# Altium schematic sheet Main.SchDoc
size A4; Author: Wojciech Gredel; CompanyName: AGH UST; Revision: 1; ProjectName: My_project1
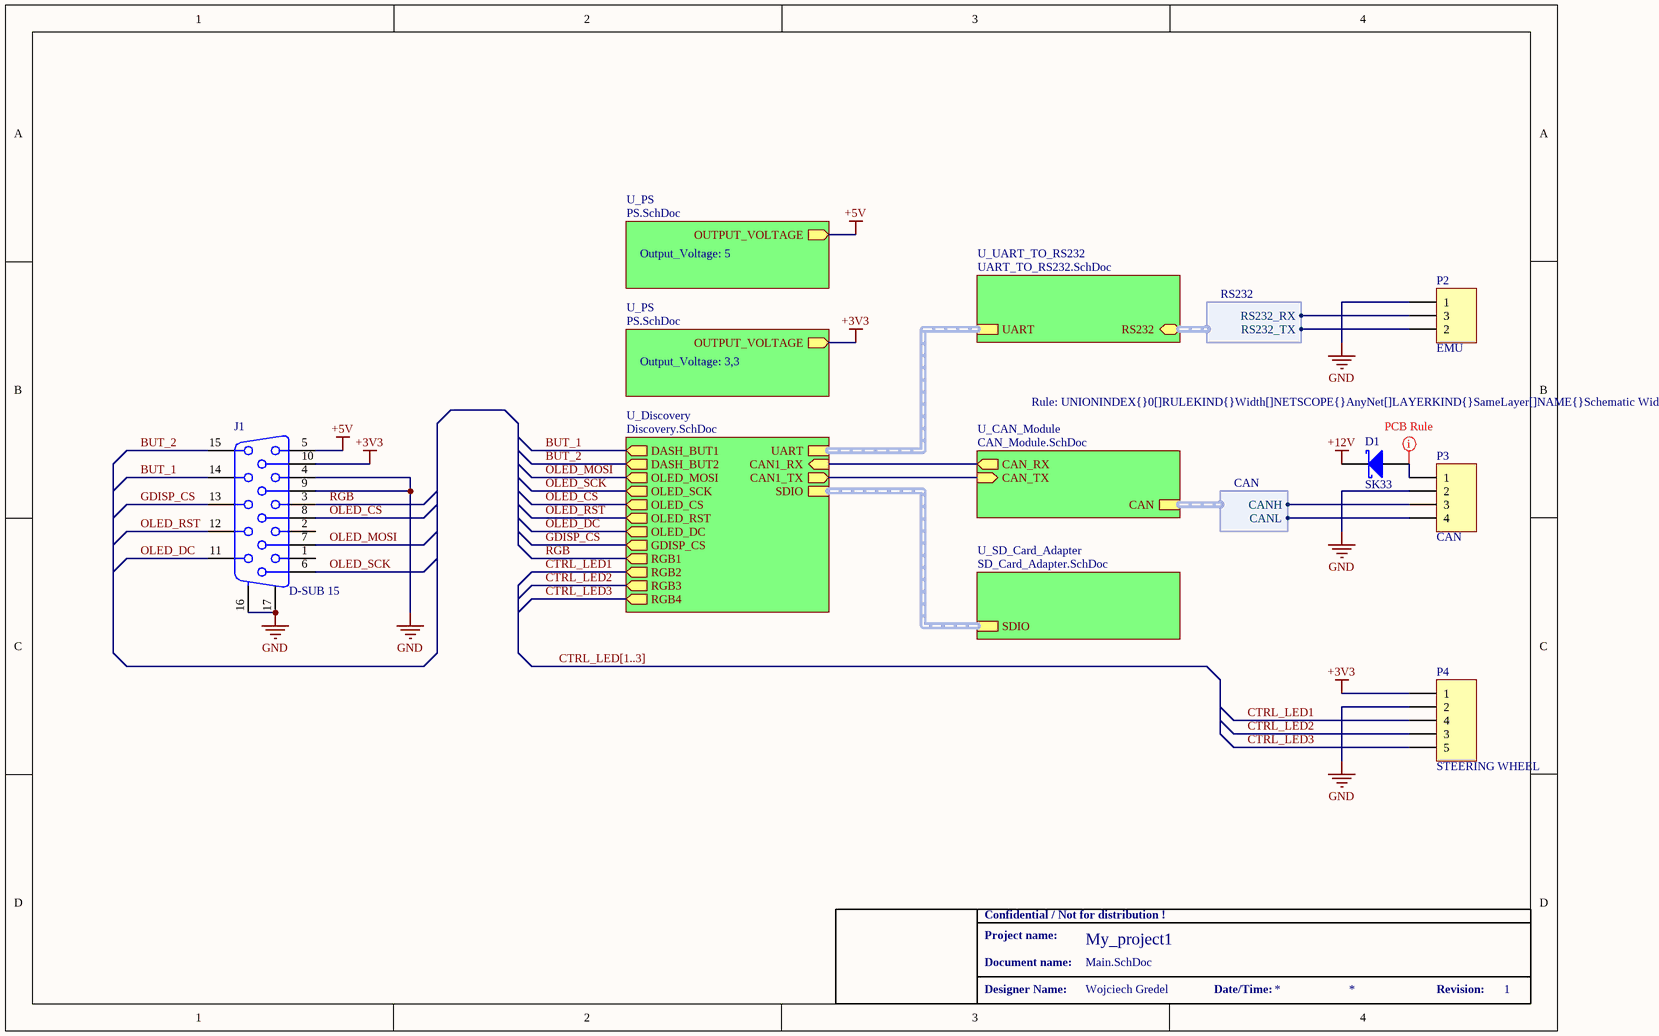
[diagram p0: Main.SchDoc]

## Parts
D1  SK33  [DO214AB_IPC_MD]
J1  D-SUB 15  [Dsub-3H15]
P2  EMU  [HDR_1x3_3_94_LOCKING]
P3  CAN  [HDR_1x4_3_94_LOCKING]
P4  STEERING WHEEL  [HDR_1x5_3_94_LOCKING]

## Sub-sheets
U_CAN_Module = CAN_Module.SchDoc: CAN (harness CAN), CAN_RX (out), CAN_TX (in)
U_Discovery = Discovery.SchDoc: UART (harness UART), SDIO (harness SDIO), DASH_BUT2 (out), OLED_MOSI (out), DASH_BUT1 (out), OLED_SCK (out), OLED_CS (out), OLED_RST (out), OLED_DC (out), GDISP_CS (out), CAN1_RX (in), CAN1_TX (out), RGB1 (out), RGB2 (out), RGB3 (out), RGB4 (out)
U_PS = PS.SchDoc: OUTPUT_VOLTAGE (out)  | Output_Voltage: 5
U_PS = PS.SchDoc: OUTPUT_VOLTAGE (out)  | Output_Voltage: 3,3
U_SD_Card_Adapter = SD_Card_Adapter.SchDoc: SDIO (harness SDIO)
U_UART_TO_RS232 = UART_TO_RS232.SchDoc: UART (harness UART), RS232 (harness RS232)

## Harnesses
CAN: CANH, CANL
RS232: RS232_RX, RS232_TX

## Nets
+3V3: J1.10 P4.1 ; sheet U_PS/OUTPUT_VOLTAGE
+5V: J1.5 ; sheet U_PS/OUTPUT_VOLTAGE
+12V: D1.2(K)
GND: J1.4 J1.9 J1.16(MH1) J1.17(MH2) P2.1 P3.2 P4.2
BUT_1: J1.14 ; sheet U_Discovery/DASH_BUT1
BUT_2: J1.15 ; sheet U_Discovery/DASH_BUT2
CTRL_LED1: P4.4 ; sheet U_Discovery/RGB2
CTRL_LED2: P4.3 ; sheet U_Discovery/RGB3
CTRL_LED3: P4.5 ; sheet U_Discovery/RGB4
GDISP_CS: J1.13 ; sheet U_Discovery/GDISP_CS
OLED_CS: J1.8 ; sheet U_Discovery/OLED_CS
OLED_DC: J1.11 ; sheet U_Discovery/OLED_DC
OLED_MOSI: J1.7 ; sheet U_Discovery/OLED_MOSI
OLED_RST: J1.12 ; sheet U_Discovery/OLED_RST
OLED_SCK: J1.6 ; sheet U_Discovery/OLED_SCK
RGB: J1.3 ; sheet U_Discovery/RGB1
NetD1_1: D1.1(A) P3.1
NetP2_2: P2.2 ; sheet U_UART_TO_RS232/RS232.RS232_TX
NetP2_3: P2.3 ; sheet U_UART_TO_RS232/RS232.RS232_RX
NetP3_3: P3.3 ; sheet U_CAN_Module/CAN.CANH
NetP3_4: P3.4 ; sheet U_CAN_Module/CAN.CANL
(unnamed): sheet U_CAN_Module/CAN_RX, sheet U_Discovery/CAN1_RX
(unnamed): sheet U_CAN_Module/CAN_TX, sheet U_Discovery/CAN1_TX

Not connected (* = marked no-connect by the designer): J1 1 2

## Buses and harness runs
bus CTRL_LED[1..3]
harness sheet U_Discovery/SDIO = sheet U_SD_Card_Adapter/SDIO
harness sheet U_Discovery/UART = sheet U_UART_TO_RS232/UART

## Layout directives
rule Width Constraint [Pref Width = 25mil    Min Width = 20mil    Max Width = 30mil]: NetD1_1

## Notes on the sheet
- Confidential / Not for distribution !
- Project name:
- Document name:
- Designer Name:
- Date/Time:
- Revision:

## Library data of the parts
D1 = SK33: Schottky Diode; Manufacturer: Diotec; ManufacturerURL: http://diotec.com/tl_files/diotec/files/pdf/datasheets/sk32; Supplier: TME; Supplier Part Number: SK33-DIO
J1 = D-SUB 15: Receptacle Assembly, 15-Pin, Sim Line Connector; Manufacturer: TE Connectivity; PackageDocument: B; Positions: 15; Gender: Receptacle Header; Published: 15-Jun-2001; LatestRevisionDate: 17-Jul-2002; LatestRevisionNote: Re-released for DXP Platform.; DatasheetDocument: 24-Nov-1999; PackageReference: 788574; Publisher: Altium Limited; Orientation: Right Angle; Supplier: TME; Supplier Part Number: 1-1734530-3
P2 = MHDR1X3: ST1212 3 pin waterproof connector; Manufacturer: Joint Tech; LatestRevisionDate: 17-Jul-2002; LatestRevisionNote: Re-released for DXP Platform.; Publisher: Altium Limited; Supplier: TME; Supplier Part Number: A3960WV-03P
P3 = Header 4: Header, 4-Pin; Manufacturer: Joint Tech; LatestRevisionDate: 17-Jul-2002; LatestRevisionNote: Re-released for DXP Platform.; Publisher: Altium Limited; Supplier: TME; Supplier Part Number: A3960WV-04P
P4 = Header 5: Header, 5-Pin; Manufacturer: Joint Tech; LatestRevisionDate: 17-Jul-2002; LatestRevisionNote: Re-released for DXP Platform.; Publisher: Altium Limited; Supplier: TME; Supplier Part Number: A3960WV-05P